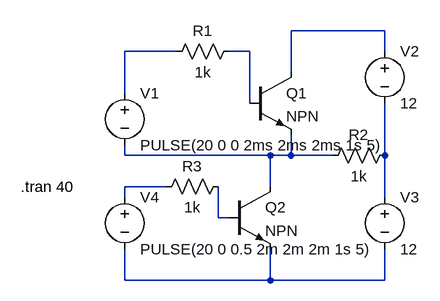
[diagram p0: schematic HalfBridgeRload_inv.asc]
HalfBridgeRload_inv.asc, the LTspice schematic file:
Version 4
SHEET 1 880 680
WIRE 560 144 416 144
WIRE 240 176 160 176
WIRE 352 176 320 176
WIRE 560 176 560 144
WIRE 416 208 416 144
WIRE 160 240 160 176
WIRE 352 256 352 176
WIRE 160 336 160 320
WIRE 384 336 160 336
WIRE 416 336 416 304
WIRE 416 336 384 336
WIRE 480 336 416 336
WIRE 560 336 560 256
WIRE 224 384 160 384
WIRE 384 384 384 336
WIRE 160 400 160 384
WIRE 560 400 560 336
WIRE 304 432 304 384
WIRE 320 432 304 432
WIRE 160 528 160 480
WIRE 384 528 384 480
WIRE 384 528 160 528
WIRE 560 528 560 480
WIRE 560 528 384 528
SYMBOL voltage 160 224 R0
SYMATTR InstName V1
SYMATTR Value PULSE(20 0 0 2ms 2ms 2ms 1s 5)
SYMBOL res 336 160 R90
WINDOW 0 0 56 VBottom 2
WINDOW 3 32 56 VTop 2
SYMATTR InstName R1
SYMATTR Value 1k
SYMBOL res 576 320 R90
WINDOW 0 0 56 VBottom 2
WINDOW 3 32 56 VTop 2
SYMATTR InstName R2
SYMATTR Value 1k
SYMBOL voltage 560 160 R0
SYMATTR InstName V2
SYMATTR Value 12
SYMBOL npn 352 208 R0
SYMATTR InstName Q1
SYMBOL voltage 560 384 R0
SYMATTR InstName V3
SYMATTR Value 12
SYMBOL voltage 160 384 R0
SYMATTR InstName V4
SYMATTR Value PULSE(20 0 0.5 2m 2m 2m 1s 5)
SYMBOL res 320 368 R90
WINDOW 0 0 56 VBottom 2
WINDOW 3 32 56 VTop 2
SYMATTR InstName R3
SYMATTR Value 1k
SYMBOL npn 320 384 R0
SYMATTR InstName Q2
TEXT 0 384 Left 2 !.tran 40

The netlist it stands for:
* HalfBridgeRload_inv.asc
V1 N002 N004 PULSE(20 0 0 2ms 2ms 2ms 1s 5)
R1 N003 N002 1k
R2 N005 N004 1k
V2 N001 N005 12
Q1 N001 N003 N004 0 NPN
V3 N005 N008 12
V4 N006 N008 PULSE(20 0 0.5 2m 2m 2m 1s 5)
R3 N007 N006 1k
Q2 N004 N007 N008 0 NPN
.model NPN NPN
.model PNP PNP
.lib standard.bjt
.tran 40
.backanno
.end